# Altium schematic sheet CC2530Controller.SchDoc
size A3
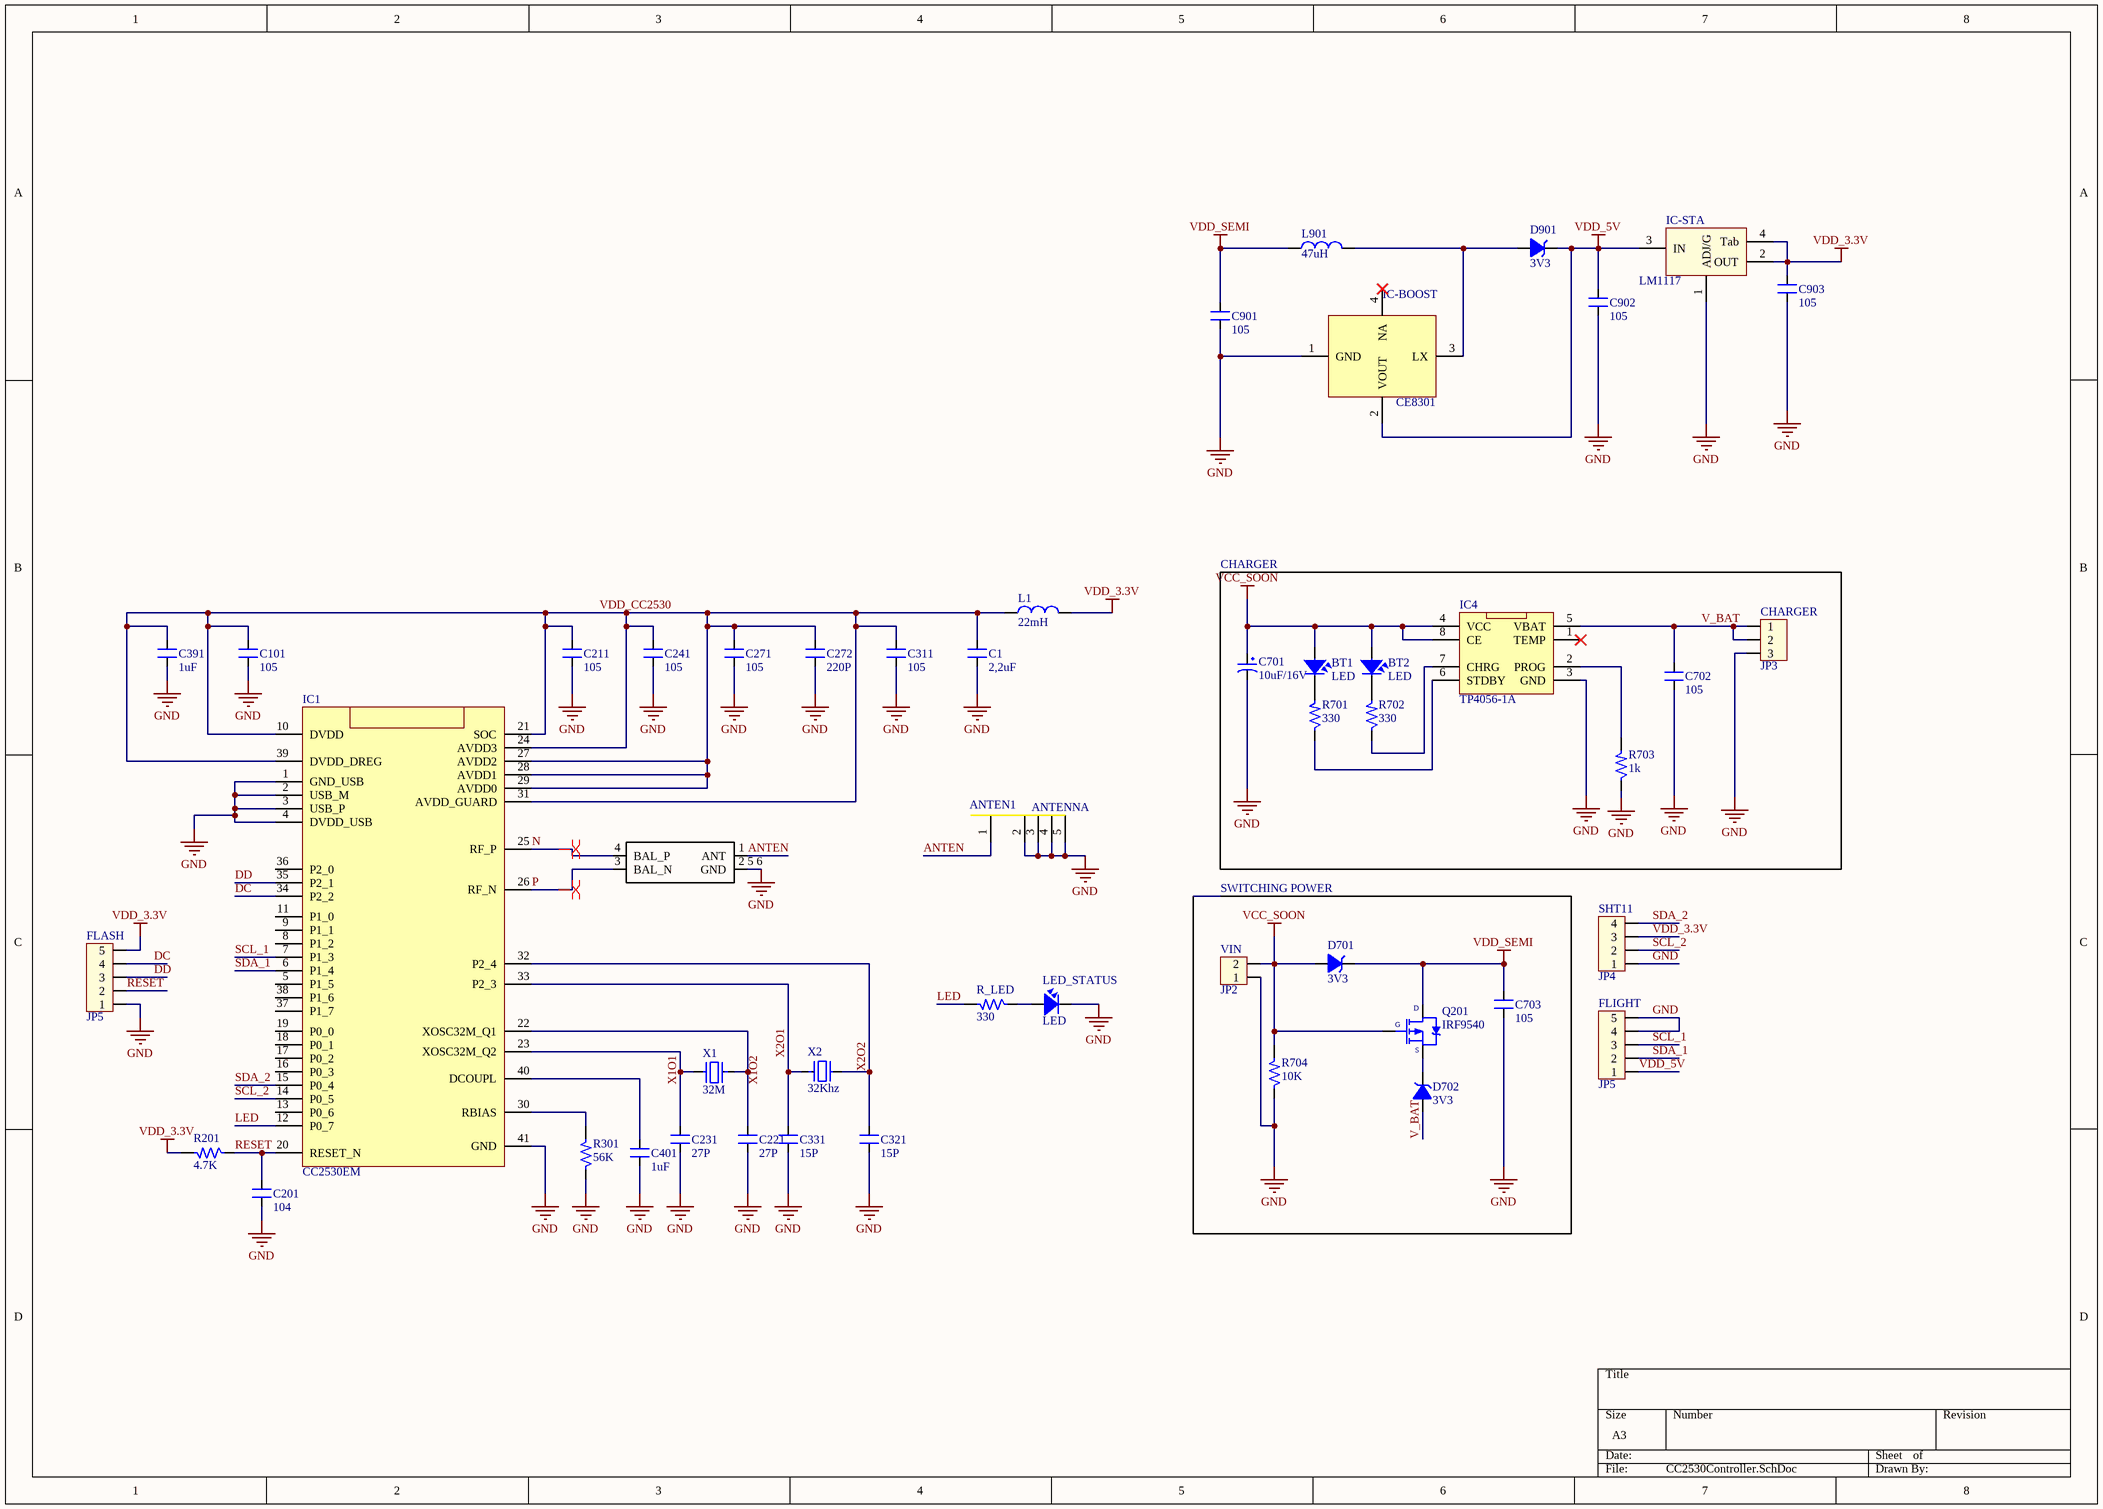
[diagram p0: CC2530Controller.SchDoc]

## Parts
ANTEN1  ANTENNA  [ANTEN.08-H5]
B1  2450BM15A0002  [2450BM_2450BM15A0002(Primary)]  (value not drawn)
BT1  LED  [LED0805-Blue]
BT2  LED  [LED0805-Blue]
C1  2,2uF  [0402 (REFLOW LF)]
C101  105  [0402 (REFLOW LF)]
C201  104  [0402 (REFLOW LF)]
C211  105  [0402 (REFLOW LF)]
C221  27P  [0402 (REFLOW)]
C231  27P  [0402 (REFLOW)]
C241  105  [0402 (REFLOW LF)]
C271  105  [0402 (REFLOW LF)]
C272  220P  [0402 (REFLOW LF)]
C311  105  [0402 (REFLOW LF)]
C321  15P  [0402 (REFLOW LF)]
C331  15P  [0402 (REFLOW LF)]
C391  1uF  [0402 (REFLOW LF)]
C401  1uF  [0402 (REFLOW LF)]
C701  10uF/16V  [CAP-B-22UF/16V]
C702  105  [0402 (REFLOW LF)]
C703  105  [0402 (REFLOW LF)]
C901  105  [0402 (REFLOW LF)]
C902  105  [0402 (REFLOW LF)]
C903  105  [0402 (REFLOW LF)]
CHARGER  JP3  [CON3]
D701  3V3  [0402 (REFLOW LF)]
D702  3V3  [0402 (REFLOW LF)]
D901  3V3  [SS1X-SMD]
FLASH  JP5  [CON5]
FLIGHT  JP5  [CON5]
IC1  CC2530EM  [QLP40 (Reflow)]
IC4  TP4056-1A  [TP4056-1A]
IC-BOOST  CE8301  [SOT89]
IC-STA  LM1117  [SOT223-4N]
L1  22mH  [0402 (REFLOW LF)]
L901  47uH  [LXX]
LED_STATUS  LED  [SM-0805]
Q201  IRF9540  [SOT23A]
R201  4.7K  [0402 (REFLOW LF)]
R301  56K  [0402 (REFLOW LF)]
R701  330  [0402 (REFLOW LF)]
R702  330  [0402 (REFLOW LF)]
R703  1k  [0402 (REFLOW LF)]
R704  10K  [0402 (REFLOW LF)]
R_LED  330  [0402 (REFLOW LF)]
SHT11  JP4  [CON4]
VIN  JP2  [CON2]
X1  32M  [XTAL_SMD_3_2x2_5 (3.2 x 2.5 mm)]
X2  32Khz  [XTAL_SMD_85SMX (8.7x3.8mm)]

## Blocks framed on the sheet
CHARGER: BT1 BT2 C701 C702 CHARGER IC4 R701-R703

## Nets
GND: ANTEN1.2 ANTEN1.3 ANTEN1.4 ANTEN1.5 B1.2_5_6(GND) C1.1 C101.1 C201.1 C211.1 C221.1 C231.1 C241.1 C271.1 C272.1 C311.1 C321.1 C331.1 C391.1 C401.1 C701.2 C702.1 C703.1 C901.2 C902.2 C903.2 CHARGER.3 FLASH.1 FLIGHT.4 FLIGHT.5 IC1.1(GND_USB) IC1.2(USB_M) IC1.3(USB_P) IC1.4(DVDD_USB) IC1.41(GND) IC4.3(GND) IC-BOOST.1(GND) IC-STA.1(ADJ/G) LED_STATUS.2 R301.1 R703.1 R704.1 SHT11.1 VIN.1
VCC_SOON: BT1.1 BT2.1 C701.1 D701.1(A) IC4.4(VCC) IC4.8(CE) Q201.1(G) R704.2 VIN.2
VDD_3.3V: C903.1 FLASH.5 IC-STA.2(OUT) IC-STA.4(Tab) L1.2 R201.2 SHT11.3
VDD_5V: C902.1 D901.2(K) FLIGHT.1 IC-BOOST.2(VOUT) IC-STA.3(IN)
VDD_SEMI: C703.2 C901.1 D701.2(K) L901.1 Q201.2(D)
ANTEN: ANTEN1.1 B1.1(ANT)
DC: FLASH.4 IC1.34(P2_2)
DD: FLASH.3 IC1.35(P2_1)
LED: IC1.12(P0_7) R_LED.2
N: B1.4(BAL_P) IC1.25(RF_P)
P: B1.3(BAL_N) IC1.26(RF_N)
RESET: C201.2 FLASH.2 IC1.20(RESET_N) R201.1
SCL_1: FLIGHT.3 IC1.7(P1_3)
SCL_2: IC1.14(P0_5) SHT11.2
SDA_1: FLIGHT.2 IC1.6(P1_4)
SDA_2: IC1.15(P0_4) SHT11.4
V_BAT: C702.2 CHARGER.1 CHARGER.2 D702.1(A) IC4.5(VBAT)
VDD_CC2530: C1.2 C101.2 C211.2 C241.2 C271.2 C272.2 C311.2 C391.2 IC1.10(DVDD) IC1.21(SOC) IC1.24(AVDD3) IC1.27(AVDD2) IC1.28(AVDD1) IC1.29(AVDD0) IC1.31(AVDD_GUARD) IC1.39(DVDD_DREG) L1.1
X1O1: C231.2 IC1.23(XOSC32M_Q2) X1.1
X2O1: C331.2 IC1.33(P2_3) X2.4
X2O2: C321.2 IC1.32(P2_4) X2.1
NetBT1_2: BT1.2 R701.2
NetBT2_2: BT2.2 R702.2
NetC221_2: C221.2 IC1.22(XOSC32M_Q1) X1.3
NetC401_2: C401.2 IC1.40(DCOUPL)
NetD702_2: D702.2(K) Q201.3(S)
NetD901_1: D901.1(A) IC-BOOST.3(LX) L901.2
NetIC1_30: IC1.30(RBIAS) R301.2
NetIC4_2: IC4.2(PROG) R703.2
NetIC4_6: IC4.6(STDBY) R701.1
NetIC4_7: IC4.7(CHRG) R702.1
NetLED_STATUS_1: LED_STATUS.1 R_LED.1

Not connected (* = marked no-connect by the designer): IC1 5(P1_5) 8(P1_2) 9(P1_1) 11(P1_0) 13(P0_6) 16(P0_3) 17(P0_2) 18(P0_1) 19(P0_0) 36(P2_0) 37(P1_7) 38(P1_6); IC4 1(TEMP)*; IC-BOOST 4(NA)*

## Layout directives
differential pair: N, P

## Notes on the sheet
- SWITCHING POWER
- Labels drawn without touching a wire or pin: X1O2

## Library data of the parts
B1 = 2450BM15A0002_1: Value: *
BT1 BT2 LED_STATUS = LED: LED Single colour Green and Red; Value: LED 3 ly Single Colour
C1 C101 C201 C211 C221 C231 C241 C271 C272 C311 C321 C331 C391 C401 C702 C703 C901-C903 = CM: Cap SMD; Value: 103
C701 = CP3: Cap 100uF/35V - 470uF/16V; Value: 100uF/35V/50V; Description 1: 1000uF/6,3V - 470uF/16V - 330uF - 25V; Description 2: 220uF/35V - 100uF/50V - 63V - 4,7uF/200V; Description 3: 22uF => 33uF100V - 3,3uF => 4,7uF/250V; Description 4: 2,2uF =>3,3uF/350 - 2,2uF/400V - 1uF/450V
CHARGER = Con3: Connector 3; Value: Connector 3
D701 D702 D901 = DZ: Diode Zenner; Value: 3v3
FLASH FLIGHT = Con5: Connector 5; Value: Connector 5
IC-BOOST = CE8301: CE8301-SOT-89-3
IC-STA = LM1117: 3v3; Value: LM317
L1 L901 = L1: Inductor; Value: 150 mH
Q201 = IRF9540: HEXFET P-Channel Power MOSFET; Note: Pin 2 is electrically connected to pin 4.; Published: 8-Jun-2000; LatestRevisionDate: 17-Jul-2002; LatestRevisionNote: Re-released for DXP Platform.; DatasheetVersion: PD-9.421C; PackageVersion: Feb-1997; PackageReference: TO-220AB; Publisher: Altium Limited; PackageDescription: TO, Thru-Hole, Vertical, Heatsink Mounted; 3 In-Line Leads; Pitch 2.54 mm; ComponentLink1Description: Manufacturer Link; ComponentLink1URL: http://www.irf.com/; ComponentLink2Description: Datasheet; ComponentLink2URL: http://www.irf.com/product-info/datasheets/data/irf9540.pdf
R201 R301 R701-R704 R_LED = R: Resistor 1/4W; Value: R1/4W - 1K
SHT11 = Con4: Connector 4; Value: Connector 4
VIN = Con2: Connector 2; Value: Connector 2
X1 = XT2_SMD_32M: Crystal For all Crystal 2pin.; Value: 4Mhz
X2 = XT2_SMD_32KHz: Crystal For all Crystal 2pin.; Value: 4Mhz